# Altium schematic sheet Copy of User Interface.SchDoc
size A; SheetNumber: 5; SheetTotal: 7
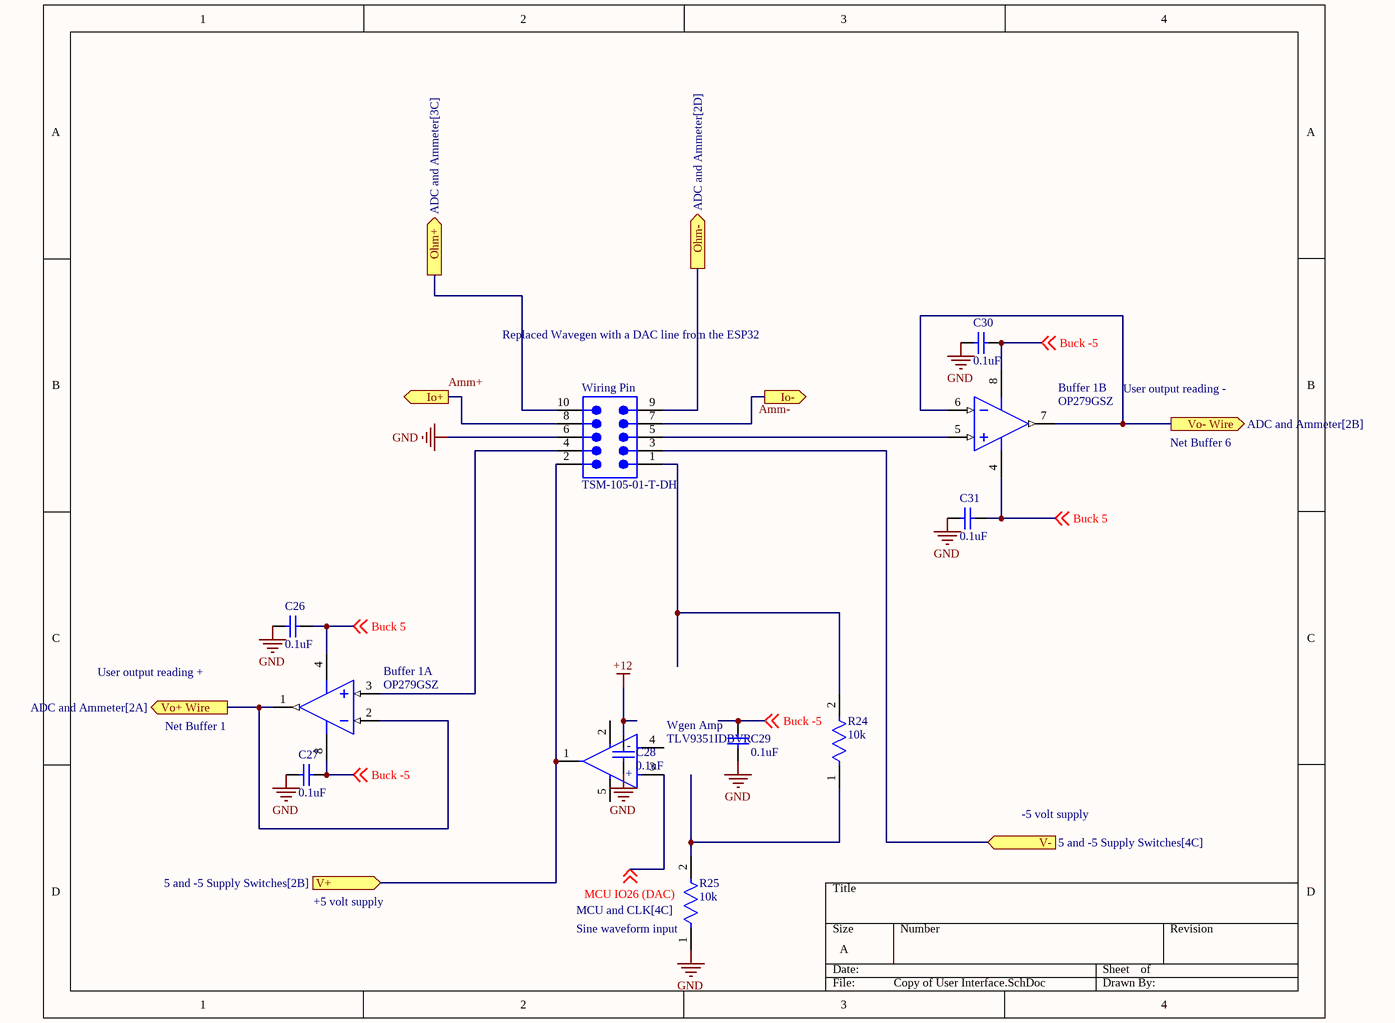
[diagram p0: Copy of User Interface.SchDoc]

## Parts
Buffer_1  OP279GSZ  [ADI-R-8_N]  (parts A,B of 2)
C26  0.1uF  [CAPC2013X94X50LL20T25]
C27  0.1uF  [CAPC2013X94X50LL20T25]
C28  0.1uF  [CAPC2013X94X50LL20T25]
C29  0.1uF  [CAPC2013X94X50LL20T25]
C30  0.1uF  [CAPC2013X94X50LL20T25]
C31  0.1uF  [CAPC2013X94X50LL20T25]
R24  10k  [FP-RK73H1J-IPC_B]
R25  10k  [FP-RK73H1J-IPC_B]
Wgen_Amp  TLV9351IDBVR  [FP-DBV0005A-IPC_C]
Wiring_Pin  TSM-105-01-T-DH  [SMTC-TSM-105-01-X-DH]

## Ports
Io+ (out, see ADC and Ammeter[6C]), Io- (out, see ADC and Ammeter[6C]), Ohm+ (out, see ADC and Ammeter[3C]), Ohm- (out, see ADC and Ammeter[2D]), V+ (in, see 5 and -5 Supply Switches[2B]), V- (in, see 5 and -5 Supply Switches[4C]), Vo+ Wire (out, see ADC and Ammeter[2A]), Vo- Wire (out, see ADC and Ammeter[2B])

## Nets
+12: C28.2
GND: C26.1 C27.1 C28.1 C29.1 C30.1 C31.1 R25.1 Wiring_Pin.6
Buck 5: Buffer_1.4(-V) C26.2 C31.2 ; off-sheet Buck 5
Buck -5: Buffer_1.8(+V) C27.2 C29.2 C30.2 ; off-sheet Buck -5
Io+: Wiring_Pin.8 ; port Io+
Io-: Wiring_Pin.7 ; port Io-
MCU IO26 (DAC): Wgen_Amp.3(IN+) ; off-sheet MCU IO26 (DAC)
Ohm+: Wiring_Pin.10 ; port Ohm+
Ohm-: Wiring_Pin.9 ; port Ohm-
V+: Wgen_Amp.1(OUT) Wiring_Pin.2 ; port V+
V-: Wiring_Pin.3 ; port V-
Vo+ Wire: Buffer_1.1(OUT_A) Buffer_1.2(-IN_A) ; port Vo+ Wire
Vo- Wire: Buffer_1.6(-IN_B) Buffer_1.7(OUT_B) ; port Vo- Wire
NetBuffer_1_3: Buffer_1.3(+IN_A) Wiring_Pin.4
NetBuffer_1_5: Buffer_1.5(+IN_B) Wiring_Pin.5
NetR24_1: R24.1 R25.2
NetR24_2: R24.2 Wiring_Pin.1

Not connected (* = marked no-connect by the designer): Wgen_Amp 2(V-) 4(IN-) 5(V+)

## Notes on the sheet
- Replaced Wavegen with a DAC line from the ESP32
- User output reading -
- Net Buffer 6
- User output reading +
- Net Buffer 1
- -5 volt supply
- +5 volt supply
- (near R25) Sine waveform input
- Labels drawn without touching a wire or pin: Amm+, Amm-
- (in symbol CMP-04895-000384-1) -; +

## Library data of the parts
Buffer_1 = CMP-0384-00823-1: Double Channel Rail-to-Rail Operational Amplifier, 5 MHz BW, 3 V/us SR, Industrial, 8-pin SOIC (R-8), Tube; Manufacturer: Analog Devices; Generic Part Number: OP279; Iq/Amp: 3.5mA; V Span Min: 4.5V; Input Offset Voltage: 4mV; Input Bias Current: 300nA; V Span Max: 12V; Small Signal Bandwidth: 5MHz; Amplifiers Per Package: 2; Slew Rate: 3V/us; DatasheetVersion: Rev. G; PackageReference: R-8; ComponentLink3URL: http://www.analog.com/static/imported-files/packages/PKG_PDF/SOIC_Narrow%20(R)/R_8.pdf; ComponentLink2Description: Datasheet; PartNumber: OP279GSZ; ComponentLink3Description: Package Specification; Mounting Technology: Surface Mount; PackageDescription: 8-Pin Standard Small Outline Package, Body 3.9 x 4.9 mm, Pitch 1.27 mm; PackageVersion: 060506-A; Code_JEDEC: MS-012-AA; ComponentLink1URL: http://www.analog.com/en/index.html; ComponentLink1Description: Manufacturer URL; ComponentLink2URL: http://www.analog.com/static/imported-files/data_sheets/OP179_279.pdf
C26-C31 = CMP-2007-04368-1: Part Number: 08055C104JAT4A; Manufacturer: AVX Interconnect / Elco
R24 R25 = CMP-2000-01751-2: 10kΩ ±1% 0.1W Chip Resistor 0603 Thick Film AEC-Q200 Qualified; Power Rating: 100mW; Temperature Coefficient: 100ppm/°C; Resistance: 10kR; Voltage Rating: 50V; Construction: Rectangular; Max Operating Temperature: 155°C; Resistor Type: Thick Film; Case/Package: 0603; Military Standard: MIL-R-55342F; Depth: 0.8mm; Termination: SMD/SMT; Min Operating Temperature: -55°C; RoHS Compliant: Yes; Width: 0.8mm; Length: 1.6mm; Height: 0.45mm; Case Code (Metric): 1608; Package Quantity: 10000; Lead Free: Lead Free; Series: RK73H; Packaging: Tape and Reel; Case Code (Imperial): 0603; Tolerance: 1%
Wgen_Amp = CMP-04895-000384-1: OPAMP
Wiring_Pin = CMP-1024-00227-1: 0.025" SQ Post Header, Surface Mount, Horizontal, -55 to 105 degC, 2.54 mm Pitch, 10-Pin, Male, RoHS; Manufacturer: Samtec; Pitch: 2.54 mm; PartNumber: TSM-105-01-T-DH; Orientation: Horizontal; ComponentLink3URL: http://www.samtec.com/documents/webfiles/cpdf/TSM-1XX-XX-XXX-XX-XX-XXX-XX-MKT1.pdf; ComponentLink2Description: Datasheet; Mounting Technology: Surface Mount; PackageDescription: Terminal Strip Double Surface Mount; RoHS: True; DatasheetVersion: F-214; Temperature Range: -55 to 105 degC; ComponentLink2URL: http://www.samtec.com/documents/webfiles/pdf/TSM.PDF; ComponentLink1Description: Manufacturer URL; ComponentLink3Description: Package Specification; PackageVersion: CH, 7/1995; ComponentLink1URL: http://www.samtec.com; PackageReference: TSM-105-01-X-DH